# Altium schematic sheet 8_U-FL-Connectors_no_GND.SchDoc
size A4; SheetNumber: 8; SheetTotal: 8
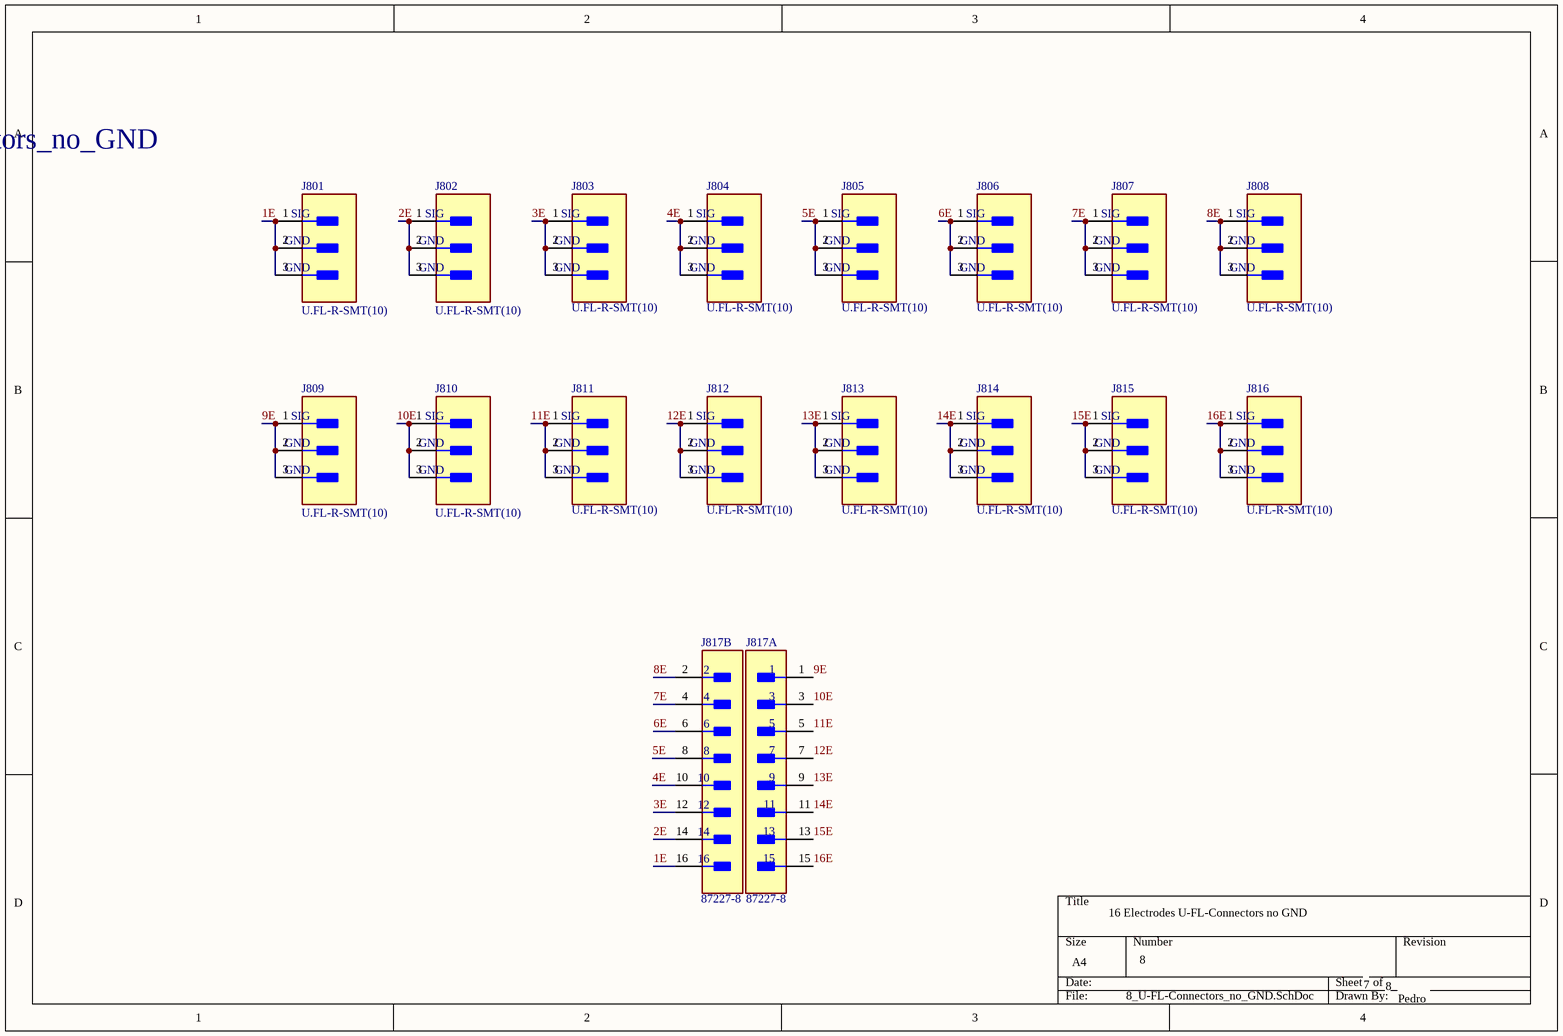
[diagram p0: 8_U-FL-Connectors_no_GND.SchDoc]

## Parts
J801  U.FL-R-SMT(10)  [FP-U_FL-R-SMT_10-MFG]
J802  U.FL-R-SMT(10)  [FP-U_FL-R-SMT_10-MFG]
J803  U.FL-R-SMT(10)  [FP-U_FL-R-SMT_10-MFG]
J804  U.FL-R-SMT(10)  [FP-U_FL-R-SMT_10-MFG]
J805  U.FL-R-SMT(10)  [FP-U_FL-R-SMT_10-MFG]
J806  U.FL-R-SMT(10)  [FP-U_FL-R-SMT_10-MFG]
J807  U.FL-R-SMT(10)  [FP-U_FL-R-SMT_10-MFG]
J808  U.FL-R-SMT(10)  [FP-U_FL-R-SMT_10-MFG]
J809  U.FL-R-SMT(10)  [FP-U_FL-R-SMT_10-MFG]
J810  U.FL-R-SMT(10)  [FP-U_FL-R-SMT_10-MFG]
J811  U.FL-R-SMT(10)  [FP-U_FL-R-SMT_10-MFG]
J812  U.FL-R-SMT(10)  [FP-U_FL-R-SMT_10-MFG]
J813  U.FL-R-SMT(10)  [FP-U_FL-R-SMT_10-MFG]
J814  U.FL-R-SMT(10)  [FP-U_FL-R-SMT_10-MFG]
J815  U.FL-R-SMT(10)  [FP-U_FL-R-SMT_10-MFG]
J816  U.FL-R-SMT(10)  [FP-U_FL-R-SMT_10-MFG]
J817  87227-8  [FP-87227-8-MFG]  (parts A,B of 2)

## Nets
1E: J801.1(SIG) J801.2(GND) J801.3(GND) J817.16
2E: J802.1(SIG) J802.2(GND) J802.3(GND) J817.14
3E: J803.1(SIG) J803.2(GND) J803.3(GND) J817.12
4E: J804.1(SIG) J804.2(GND) J804.3(GND) J817.10
5E: J805.1(SIG) J805.2(GND) J805.3(GND) J817.8
6E: J806.1(SIG) J806.2(GND) J806.3(GND) J817.6
7E: J807.1(SIG) J807.2(GND) J807.3(GND) J817.4
8E: J808.1(SIG) J808.2(GND) J808.3(GND) J817.2
9E: J809.1(SIG) J809.2(GND) J809.3(GND) J817.1
10E: J810.1(SIG) J810.2(GND) J810.3(GND) J817.3
11E: J811.1(SIG) J811.2(GND) J811.3(GND) J817.5
12E: J812.1(SIG) J812.2(GND) J812.3(GND) J817.7
13E: J813.1(SIG) J813.2(GND) J813.3(GND) J817.9
14E: J814.1(SIG) J814.2(GND) J814.3(GND) J817.11
15E: J815.1(SIG) J815.2(GND) J815.3(GND) J817.13
16E: J816.1(SIG) J816.2(GND) J816.3(GND) J817.15

## Notes on the sheet
- [8] 8_U-FL-Connectors_no_GND
- 16 Electrodes U-FL-Connectors no GND
- 8
- 7
- Pedro

## Library data of the parts
J801-J816 = eef6fde44c591823e8076210edfe12f: CONN U.FL RCPT STR 50 OHM SMD; Plating: Silver; Connector Type: Coaxial; Frequency: 6GHz; Impedance: 50R; Body Material: Bronze; Dielectric Material: Polymer; Contact Plating: Gold; Termination: Solder; Orientation: Vertical; Contact Material: Brass; Min Operating Temperature: -40°C; Mount: Surface Mount; Lead Free: Lead Free; Max Operating Temperature: 90°C; Radiation Hardening: No; Packaging: Tape and Reel; Body Plating: Silver; Fastening Type: Snap; Max Frequency: 6GHz; Depth: 3.1mm; Package Quantity: 1; Case/Package: SMD/SMT; Housing Color: Beige; Length: 3mm
J817 = CMP-03369-000064-1: CONN HEADER VERT 16POS 2.54MM; Manufacturer: TE Connectivity; Conn Gender: Male; Conn Orientation: Straight; Current Rating: 3A; Number Of Contacts: 16; Mouser Description: Headers & Wire Housings UNSHRD VERT DUAL 16; Lead Free: Yes; Digikey Description: CONN HEADER VERT 16POS 2.54MM; Device Class L3: unset; Automotive: No; Height: 0.428inch; Temperature Range Low: -65°C; Device Class L1: Connectors; RoHS: TRUE; Pitch: 2.54mm; Package: 0; Manufacturer Part Number: 87227-8; Number Of Rows: 2; Footprint Url: https://www.te.com/commerce/DocumentDelivery/DDEController?Action=showdoc&DocId=Customer+Drawing%7F87227%7FH4%7Fpdf%7FEnglish%7FENG_CD_87227_H4.pdf%7F87227-8; ComponentLink2URL: https://www.te.com/usa-en/product-87227-8.datasheet.pdf; ComponentLink2Description: Datasheet; Temperature: -65°C to +105°C; Category: Conn; Temperature Range High: +105°C; Octopart: https://octopart.com/87227-8-te+connectivity-39407754; Device Class L2: Headers and Wire Housings; Contact Material: Gold,Nickel